# Altium schematic sheet POWER.SchDoc
size A4
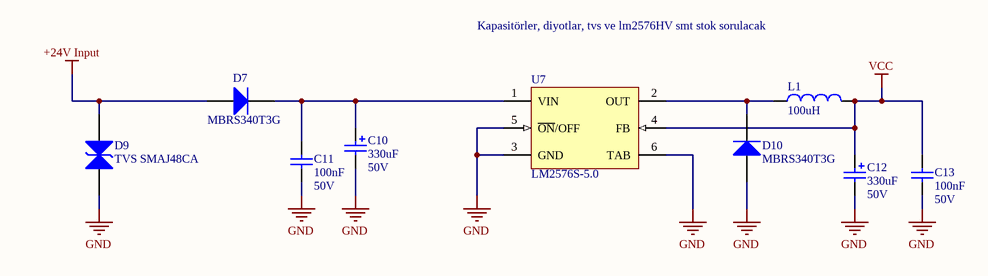
[diagram p0: POWER.SchDoc]

## Parts
C10  value 330uF  Voltage: 50V  [CAP Size H13= 12.5x13.8mm]  (hidden comment: Cap Pol1)
C11  value 100nF  Voltage: 50V  [3-0603_L]  (hidden comment: Cap)
C12  value 330uF  Voltage: 50V  [CAP Size H13= 12.5x13.8mm]  (hidden comment: Cap Pol1)
C13  value 100nF  Voltage: 50V  [3-0603_L]  (hidden comment: Cap)
D7  MBRS340T3G  [CASE 403-03 ISSUE E]
D9  TVS SMAJ48CA  [DO214 AA]
D10  MBRS340T3G  [CASE 403-03 ISSUE E]
L1  value 100uH  [EB-221M18G01]  (hidden comment: Inductor)
U7  LM2576S-5.0  [TS5B_M]

## Nets
+24V Input: D7.1(A) D9.2
GND: C10.2 C11.1 C12.2 C13.1 D9.1 D10.1(A) U7.3(GND) U7.5(~{ON}/OFF) U7.6(TAB)
VCC: C12.1 C13.2 L1.2 U7.4(FB)
NetC10_1: C10.1 C11.2 D7.2(K) U7.1(VIN)
NetD10_2: D10.2(K) L1.1 U7.2(OUT)

## Notes on the sheet
- Kapasitörler, diyotlar, tvs ve lm2576HV smt stok sorulacak

## Library data of the parts
C10 C12 = Cap Pol1: Polarized Capacitor (Radial); Published: 8-Jun-2000; Revision: July-2002: Re-released for DXP Platform.; Publisher: Altium Limited
C11 C13 = Cap: Capacitor; Published: 8-Jun-2000; Revision: July-2002: Re-released for DXP Platform.; Publisher: Altium Limited
D7 D10 = MBRS340T3G: 3 Amp Shotky Rectifier; Published: 8-Jun-2000; LatestRevisionDate: 17-Jul-2002; LatestRevisionNote: Re-released for DXP Platform.; DatasheetDocument: 1998; PackageDocument: Aug-1999; Publisher: Altium Limited; ComponentLink1Description: Manufacturer Link; ComponentLink2Description: Datasheet
L1 = Inductor: Code_IEC: 1005; Published: 8-Jun-2000; LatestRevisionDate: 17-Jul-2002; LatestRevisionNote: Re-released for DXP Platform.; PackageReference: 0402-A; Publisher: Altium Limited; Code_JEITA: 0402
U7 = LM2576S-5.0: SIMPLE SWITCHER; 3A Step-Down Voltage Regulator; Manufacturer: National Semiconductor; PackageTopMarking: NSUZXYTT*LM2576S*-5.0 P+; Published: 4-Dec-2008; PackageVersion: revD, Apr-2005; PackageReference: TS5B; Publisher: Altium Limited; PackageDescription: TO-263, Molded, .400 x .390 x .180in, 5 Lead, .067in Pitch, Surface Mount; CompType: Switcher; PartNumber: LM2576S-5.0; RoHS: O; PinCount: 5; DigiKeyPartNumber: LM2576S-5.0-ND; Code_JEDEC: MO-169-AB; ComponentLink1Description: LM2576 Datasheet; ComponentLink1URL: http://www.national.com/ds/LM/LM2576.pdf; ComponentLink2Description: LM2576 Web Page; ComponentLink2URL: http://www.national.com/pf/LM/LM2576.html; ComponentLink3Description: TS5B Package Page; ComponentLink3URL: http://www.national.com/packaging/folders/ts5b.html
D9 = TVS SMAJ48CA: Published: 8-Jun-2000; LatestRevisionDate: 17-Jul-2002; LatestRevisionNote: Re-released for DXP Platform.; DatasheetDocument: 1998; PackageDocument: Aug-1999; PackageReference: DO-41; Publisher: Altium Limited; Code_JEDEC: DO-204-AL; ComponentLink1Description: Manufacturer Link; ComponentLink1URL: http://www.fairchildsemi.com/; ComponentLink2Description: Datasheet; ComponentLink2URL: http://www.fairchildsemi.com/ds/1N%2F1N4001.pdf